# EAGLE design MicroMod-RP2040-ProcessorBoard (EAGLE 9.6.2)
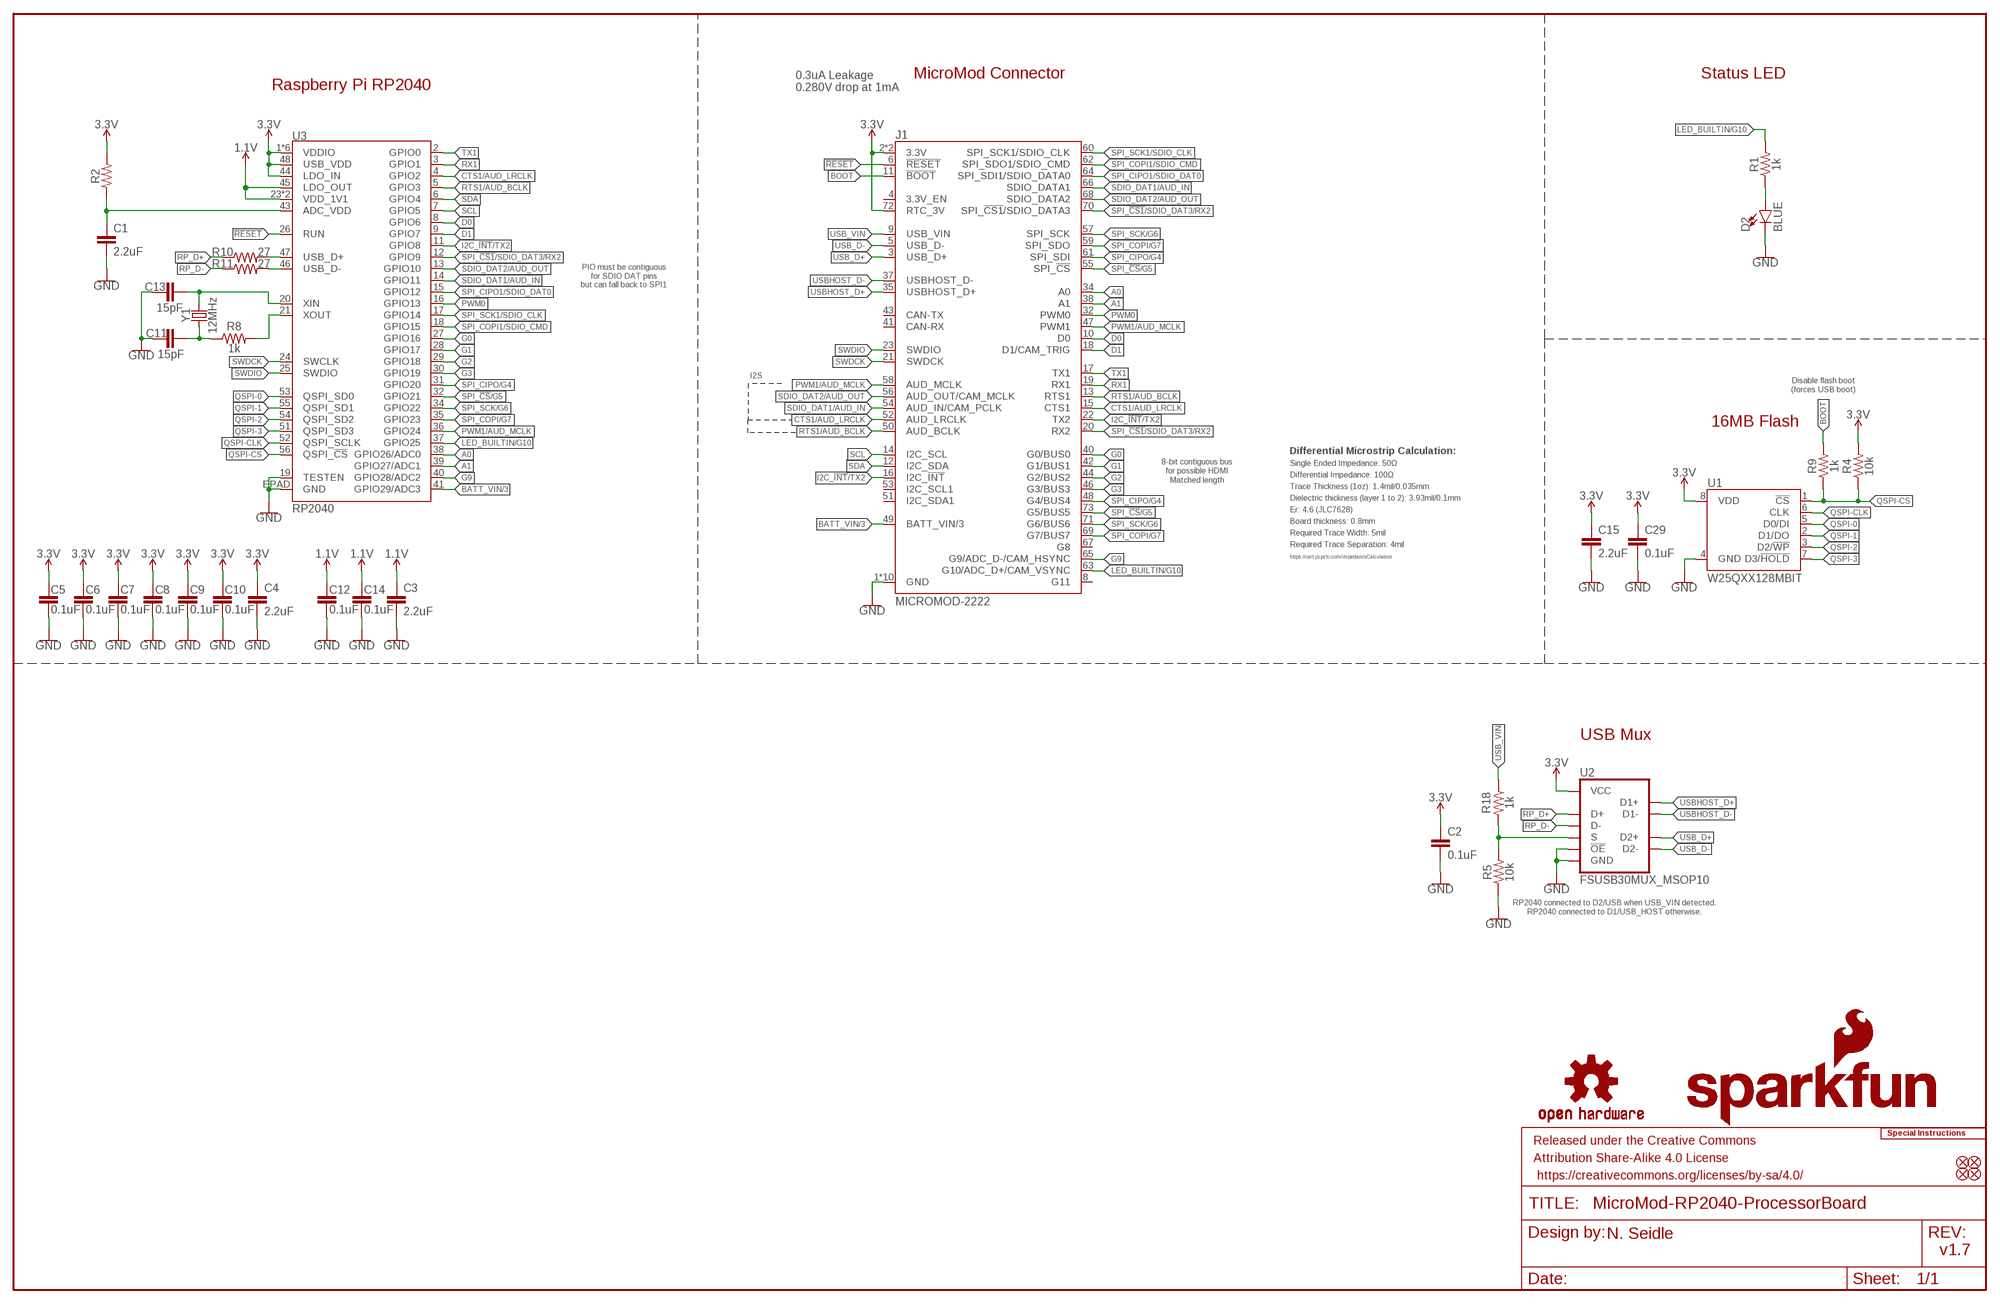
[diagram p0: schematic, sheet 1]

## Parts
C1  2.2uF  2.2UF-0402_TIGHT-10V-10%-X5R  [0402-TIGHT]
C2  0.1uF  0.1UF-0402T-6.3V-10%-X7R  [0402-TIGHT]
C3  2.2uF  2.2UF-0402_TIGHT-10V-10%-X5R  [0402-TIGHT]
C4  2.2uF  2.2UF-0402_TIGHT-10V-10%-X5R  [0402-TIGHT]
C5  0.1uF  0.1UF-0402T-6.3V-10%-X7R  [0402-TIGHT]
C6  0.1uF  0.1UF-0402T-6.3V-10%-X7R  [0402-TIGHT]
C7  0.1uF  0.1UF-0402T-6.3V-10%-X7R  [0402-TIGHT]
C8  0.1uF  0.1UF-0402T-6.3V-10%-X7R  [0402-TIGHT]
C9  0.1uF  0.1UF-0402T-6.3V-10%-X7R  [0402-TIGHT]
C10  0.1uF  0.1UF-0402T-6.3V-10%-X7R  [0402-TIGHT]
C11  15pF  15PF-0402T-50V-5%  [0402-TIGHT]
C12  0.1uF  0.1UF-0402T-6.3V-10%-X7R  [0402-TIGHT]
C13  15pF  15PF-0402T-50V-5%  [0402-TIGHT]
C14  0.1uF  0.1UF-0402T-6.3V-10%-X7R  [0402-TIGHT]
C15  2.2uF  2.2UF-0402_TIGHT-10V-10%-X5R  [0402-TIGHT]
C29  0.1uF  0.1UF-0402T-6.3V-10%-X7R  [0402-TIGHT]
D2  BLUE  LED-BLUE0603  [LED-0603]
FD1  FIDUCIALUFIDUCIAL  [FIDUCIAL-MICRO]
FD2  FIDUCIALUFIDUCIAL  [FIDUCIAL-MICRO]
FD3  FIDUCIALUFIDUCIAL  [FIDUCIAL-MICRO]
FD4  FIDUCIALUFIDUCIAL  [FIDUCIAL-MICRO]
FRAME1  FRAME-LEDGER  [CREATIVE_COMMONS]
J1  MICROMOD-2222  [M.2-CARD-E-22]
LOGO1  SFE_LOGO_NAME_FLAME.1_INCH  [SFE_LOGO_NAME_FLAME_.1]
LOGO2  SFE_LOGO_FLAME.1_INCH  [SFE_LOGO_FLAME_.1]
LOGO3  OSHW-LOGOMINI  [OSHW-LOGO-MINI]
LOGO4  SPECIAL_INSTRUCTIONS-ORDERING  [ORDERING_INSTRUCTIONS]
R1  1k  1KOHM-0402T-1/16W-1%  [0402-TIGHT]
R2  200OHM-0402T-1/16W-1%  [0402-TIGHT]
R4  10k  10KOHM-0402T-1/16W-1%  [0402-TIGHT]
R5  10k  10KOHM-0402T-1/16W-1%  [0402-TIGHT]
R8  1k  1KOHM-0402T-1/16W-1%  [0402-TIGHT]
R9  1k  1KOHM-0402T-1/16W-1%  [0402-TIGHT]
R10  27  27OHM  [0402-TIGHT]
R11  27  27OHM  [0402-TIGHT]
R18  1k  1KOHM-0402T-1/16W-1%  [0402-TIGHT]
U1  W25QXX128MBIT  W25QXX128MBIT-6X5-SKINNY_CENTER  [WSON-8-6X5-SKINNY_CENTERPAD]
U2  FSUSB30MUX_MSOP10  [MSOP10]
U3  RP2040  [QFN-56]
Y1  12MHz  CRYSTAL-12MHZ  [CRYSTAL-SMD-2X2.5MM]

## Nets
1.1V: C3.1 C12.1 C14.1 U3.23(VDD_1V1) U3.45(LDO_OUT) U3.50(VDD_1V1)
3.3V: C2.1 C4.1 C5.1 C6.1 C7.1 C8.1 C9.1 C10.1 C15.1 C29.1 J1.2(3.3V) J1.72(RTC_3V) J1.74(3.3V) R2.2 R4.2 U1.8(VDD) U2.10(VCC) U3.1(VDDIO) U3.10(VDDIO) U3.22(VDDIO) U3.33(VDDIO) U3.42(VDDIO) U3.44(LDO_IN) U3.48(USB_VDD) U3.49(VDDIO)
!RESET!: J1.6(!RESET!) U3.26(RUN)
A0: J1.34(A0) U3.38(GPIO26/ADC0)
A1: J1.38(A1) U3.39(GPIO27/ADC1)
ADC_VDD: C1.1 R2.1 U3.43(ADC_VDD)
BATT_VIN/3: J1.49(BATT_VIN/3) U3.41(GPIO29/ADC3)
BOOT: J1.11(!BOOT!) R9.2
CTS1/AUD_LRCLK: J1.15(CTS1) J1.52(AUD_LRCLK) U3.4(GPIO2)
D0: J1.10(D0) U3.8(GPIO6)
D1: J1.18(D1/CAM_TRIG) U3.9(GPIO7)
G0 [DiffPair]: J1.40(G0/BUS0) U3.27(GPIO16)
G1 [DiffPair]: J1.42(G1/BUS1) U3.28(GPIO17)
G2 [DiffPair]: J1.44(G2/BUS2) U3.29(GPIO18)
G3 [DiffPair]: J1.46(G3/BUS3) U3.30(GPIO19)
G9: J1.65(G9/ADC_D-/CAM_HSYNC) U3.40(GPIO28/ADC2)
GND: C1.2 C2.2 C3.2 C4.2 C5.2 C6.2 C7.2 C8.2 C9.2 C10.2 C11.1 C12.2 C13.1 C14.2 C15.2 C29.2 D2.C J1.1(GND) J1.7(GND) J1.33(GND) J1.36(GND) J1.39(GND) J1.45(GND) J1.75(GND) J1.GND1(GND) J1.GND2(GND) J1.GND3(GND) R5.1 U1.4(GND) U2.5(GND) U2.9(!OE!) U3.19(TESTEN) U3.EPAD(GND)
I2C_!INT!/TX2: J1.16(I2C_!INT!) J1.22(TX2) U3.11(GPIO8)
LED_BUILTIN/G10: J1.63(G10/ADC_D+/CAM_VSYNC) R1.2 U3.37(GPIO25)
N$2: D2.A R1.1
N$4: R8.2 U3.21(XOUT)
N$5: C13.2 U3.20(XIN) Y1.P3
N$6: C11.2 R8.1 Y1.P1
PWM0: J1.32(PWM0) U3.16(GPIO13)
PWM1/AUD_MCLK: J1.47(PWM1) J1.58(AUD_MCLK) U3.36(GPIO24)
QSPI-0: U1.5(D0/DI) U3.53(QSPI_SD0)
QSPI-1: U1.2(D1/DO) U3.55(QSPI_SD1)
QSPI-2: U1.3(D2/!WP!) U3.54(QSPI_SD2)
QSPI-3: U1.7(D3/!HOLD!) U3.51(QSPI_SD3)
QSPI-CLK [Clock]: U1.6(CLK) U3.52(QSPI_SCLK)
QSPI-CS: R4.1 R9.1 U1.1(!CS!) U3.56(QSPI_!CS!)
RP_D1+: R10.2 U3.47(USB_D+)
RP_D1-: R11.2 U3.46(USB_D-)
RP_D+: R10.1 U2.4(D+)
RP_D-: R11.1 U2.6(D-)
RTS1/AUD_BCLK: J1.13(RTS1) J1.50(AUD_BCLK) U3.5(GPIO3)
RX1: J1.19(RX1) U3.3(GPIO1)
SCL: J1.14(I2C_SCL) U3.7(GPIO5)
SDA: J1.12(I2C_SDA) U3.6(GPIO4)
SDIO_DAT1/AUD_IN: J1.54(AUD_IN/CAM_PCLK) J1.66(SDIO_DATA1) U3.14(GPIO11)
SDIO_DAT2/AUD_OUT: J1.56(AUD_OUT/CAM_MCLK) J1.68(SDIO_DATA2) U3.13(GPIO10)
SPI_!CS1!/SDIO_DAT3/RX2: J1.20(RX2) J1.70(SPI_!CS1!/SDIO_DATA3) U3.12(GPIO9)
SPI_!CS!/G5 [DiffPair]: J1.55(SPI_!CS!) J1.73(G5/BUS5) U3.32(GPIO21)
SPI_CIPO1/SDIO_DAT0: J1.64(SPI_SDI1/SDIO_DATA0) U3.15(GPIO12)
SPI_CIPO/G4 [DiffPair]: J1.48(G4/BUS4) J1.61(SPI_SDI) U3.31(GPIO20)
SPI_COPI1/SDIO_CMD: J1.62(SPI_SDO1/SDIO_CMD) U3.18(GPIO15)
SPI_COPI/G7 [DiffPair]: J1.59(SPI_SDO) J1.69(G7/BUS7) U3.35(GPIO23)
SPI_SCK1/SDIO_CLK: J1.60(SPI_SCK1/SDIO_CLK) U3.17(GPIO14)
SPI_SCK/G6 [DiffPair]: J1.57(SPI_SCK) J1.71(G6/BUS6) U3.34(GPIO22)
SWDCK: J1.21(SWDCK) U3.24(SWCLK)
SWDIO: J1.23(SWDIO) U3.25(SWDIO)
TX1: J1.17(TX1) U3.2(GPIO0)
USB_D+: J1.3(USB_D+) U2.3(D2+)
USB_D-: J1.5(USB_D-) U2.7(D2-)
USB_MUX_SIG: R5.2 R18.2 U2.1(S)
USB_VIN: J1.9(USB_VIN) R18.1
USBHOST_D+: J1.35(USBHOST_D+) U2.2(D1+)
USBHOST_D-: J1.37(USBHOST_D-) U2.8(D1-)
Unconnected: J1.4(3.3V_EN) J1.8(G11) J1.41(CAN-RX) J1.43(CAN-TX) J1.51(I2C_SDA1) J1.53(I2C_SCL1) J1.67(G8)

## Notes on the sheet
- MicroMod Connector | Status LED
- Raspberry Pi RP2040
- 0.3uA Leakage
  0.280V drop at 1mA
- PIO must be contiguous
  for SDIO DAT pins
  but can fall back to SPI1
- I2S
- Disable flash boot
  (forces USB boot)
- 16MB Flash
- Differential Microstrip Calculation:
- 8-bit contiguous bus
  for possible HDMI
- Single Ended Impedance: 50Ω
- Differential Impedance: 100Ω
- Matched length
- Trace Thickness (1oz): 1.4mil/0.035mm
- Dielectric thickness (layer 1 to 2): 3.93mil/0.1mm
- Er: 4.6 (JLC7628)
- Board thickness: 0.8mm
- Required Trace Width: 5mil
- Required Trace Separation: 4mil
- https://cart.jlcpcb.com/impedanceCalculation
- USB Mux
- RP2040 connected to D2/USB when USB_VIN detected.
  RP2040 connected to D1/USB_HOST otherwise.
- N. Seidle
- v1.7

## Library data of the parts
C1 C3 C4 C15 = SparkFun-Capacitors:2.2UF: 2.2µF ceramic capacitors A capacitor is a passive two-terminal electrical component used to store electrical energy temporarily in an electric field.; PROD_ID: CAP-14232
C2 C5-C10 C12 C14 C29 = SparkFun-Capacitors:0.1UF: 0.1µF ceramic capacitors A capacitor is a passive two-terminal electrical component used to store electrical energy temporarily in an electric field.; PROD_ID: CAP-14993
C11 C13 = SparkFun-Capacitors:15PF: 15pF ceramic capacitors A capacitor is a passive two-terminal electrical component used to store electrical energy temporarily in an electric field.; PROD_ID: CAP-13063
D2 = SparkFun-LED:LED-BLUE: Blue SMD LED Used in manufacturing of various products at SparkFun Packages: 0603 - SMD 0603 package [Product Link] <http://www.digikey.com/product-detail/en/SMLE12BC7TT86/511-1589-2-ND/1641808> 1206 - SMD1206 package [Product Link] <http://www.digikey.com/product-detail/en/lite-on-inc/LTST-C150TBKT/160-1643-1-ND/573584> SparkFun Products: ESP8266 Thing-Dev Board <https://www.sparkfun.com/products/13711> RedBoard <https://www.sparkfun.com/products/12757>; PROD_ID: DIO-08575
FD1-FD4 = SparkFun-Aesthetics:FIDUCIAL: Fiducial Alignment Points Point-of-reference for pick-and-place machines and other optical instruments.
FRAME1 = SparkFun-Aesthetics:FRAME-LEDGER: Schematic Frame - Ledger Standard 11x14 US Ledger frame
J1 = SparkFun-MicroMod:MICROMOD: MicroMod Connector Description: A card edge connector and mating PCB connector to allow various MicroMod Processor Boards to be coupled with various carrier boards of different capabilities. Based on the M.2 standard.
LOGO1 = SparkFun-Aesthetics:SFE_LOGO_NAME_FLAME: SparkFun Font Logo w/ Flame This is the SparkFun full logo. The logo on the schematic will always be the same size; the package variant is the height of the flame part of the logo. Default layer for the logo on the board is tSilk.
LOGO2 = SparkFun-Aesthetics:SFE_LOGO_FLAME: SparkFun Flame Logo This is the SparkFun flame logo. The logo on the schematic will always be the same size; the package variant is the height of the flame. Default layer for the logo on the board is tSilk.
LOGO3 = SparkFun-Aesthetics:OSHW-LOGO: Open-Source Hardware (OSHW) Logo This logo indicates the piece of hardware it is found on incorporates a OSHW license and/or adheres to the definition of open source hardware found here: http://freedomdefined.org/OSHW
LOGO4 = SparkFun-Aesthetics:SPECIAL_INSTRUCTIONS: Special Ordering/Production Instructions Alert Symbol for special PCB ordering instructions or unique production process warnings. Ordering Instructions Production Instructions Types of information that should be added to box: Copper weight Soldermask color Silk color PCB thickness Number of layers PCB Standard: 1.6mm FR4 1 oz copper immersion silver plating red soldermask white silkscreen Types of information that should be added to box: Special wash requirements Depaneling instructions Humidification Glue curing Default text settings: 0.07 inch 9% ratio 50% line distance
R1 R8 R9 R18 = SparkFun-Resistors:1KOHM: 1kΩ resistor A resistor is a passive two-terminal electrical component that implements electrical resistance as a circuit element. Resistors act to reduce current flow, and, at the same time, act to lower voltage levels within circuits. - Wikipedia; PROD_ID: RES-14342
R2 = SparkFun-Resistors:200OHM: 200Ω resistor A resistor is a passive two-terminal electrical component that implements electrical resistance as a circuit element. Resistors act to reduce current flow, and, at the same time, act to lower voltage levels within circuits. - Wikipedia; PROD_ID: RES-15550
R4 R5 = SparkFun-Resistors:10KOHM: 10kΩ resistor A resistor is a passive two-terminal electrical component that implements electrical resistance as a circuit element. Resistors act to reduce current flow, and, at the same time, act to lower voltage levels within circuits. - Wikipedia; PROD_ID: RES-14241
R10 R11 = SparkFun-Resistors:27OHM: 27Ω resistor A resistor is a passive two-terminal electrical component that implements electrical resistance as a circuit element. Resistors act to reduce current flow, and, at the same time, act to lower voltage levels within circuits. - Wikipedia; PROD_ID: RES-15238
U1 = SparkFun-IC-Memory:W25QXX; PROD_ID: IC-15107
U2 = SparkFun-IC-Special-Function:FSUSB30MUX; PROD_ID: IC-15569
U3 = RP2040:RP2040: Raspberry Pi RP2040 MCU 56-pin 32-bit Microcontroller with 264kB of SRAM and external flash support up to 16MB Getting Started with the RP2040 <https://pico.raspberrypi.org/getting-started/> Dual-core ARM Cortex M0+ processor, flexible clock running up to 133 MHz 264kB of SRAM, and QSPI control of common flash memory USB 1.1 Host and Device support Low-power sleep and dormant modes Drag & drop programming using mass storage over USB 26 multi-function GPIO pins 2×SPI, 2×I2C, 2×UART, 3×12-bit ADC, 16×controllable PWM channels Accurate clock and timer on-chip Temperature sensor Accelerated floating point libraries on-chip 8×Programmable IO (PIO) state machines for custom peripheral support; PROD_ID: IC-15502
Y1 = SparkFun-Clocks:CRYSTAL-12MHZ: 12.0MHz Crystal Frequency: 12.0MHz Frequency Tolerance: ±20ppm Load Capacitance: 18pF SparkFun Products: SparkFun Logomatic <https://www.sparkfun.com/products/12772> Pocket AVR Programmer <https://www.sparkfun.com/products/9825>; PROD_ID: XTAL-15540

## Net classes
1 DiffPair: width 0.127 mm, clearance 0.178 mm
2 Clock: width 0.089 mm, clearance 0.178 mm
4 InternalPower: width 0.152 mm

## Board
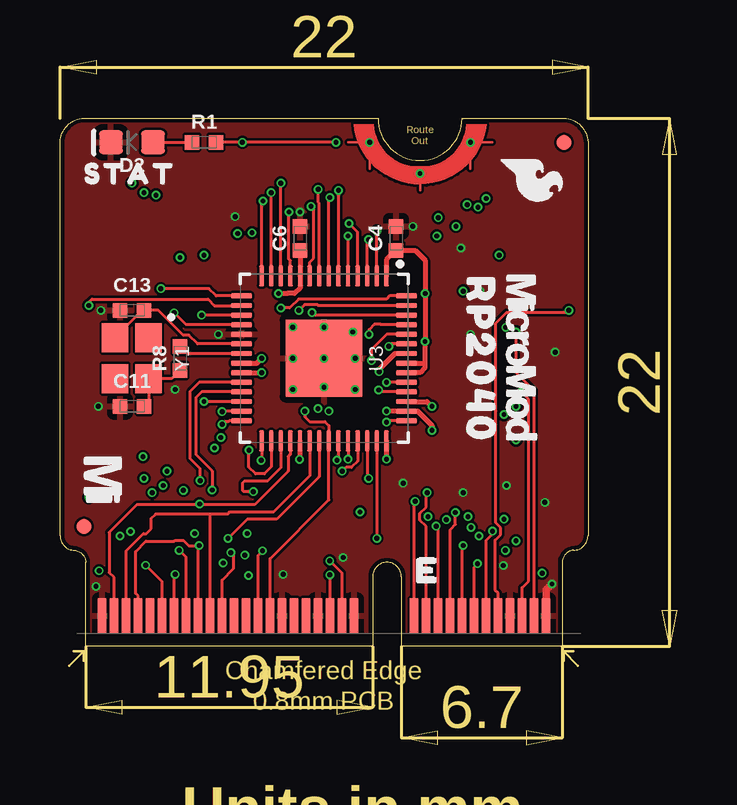
[diagram p1: board, top side]
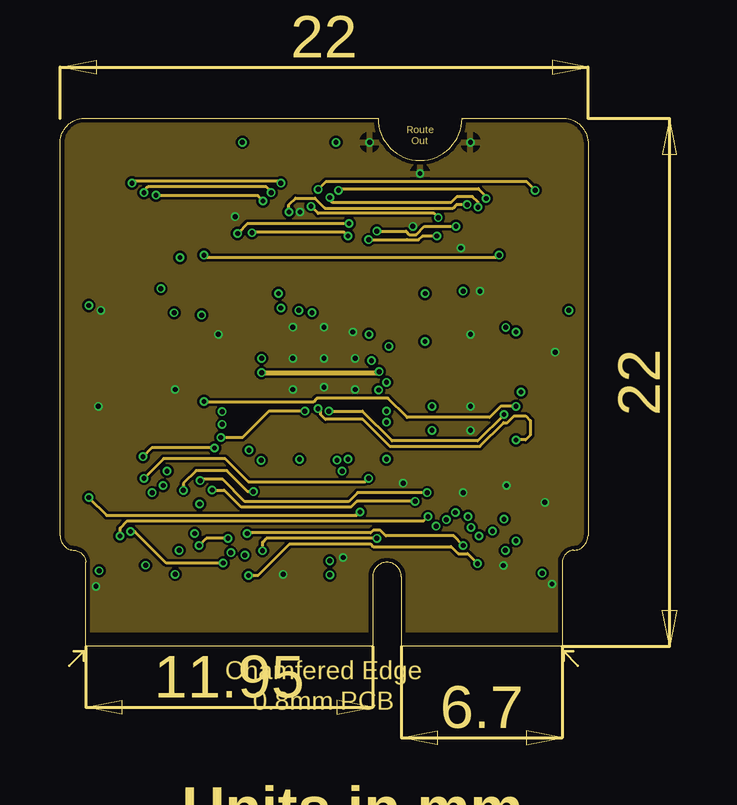
[diagram p2: board, inner layer Horz]
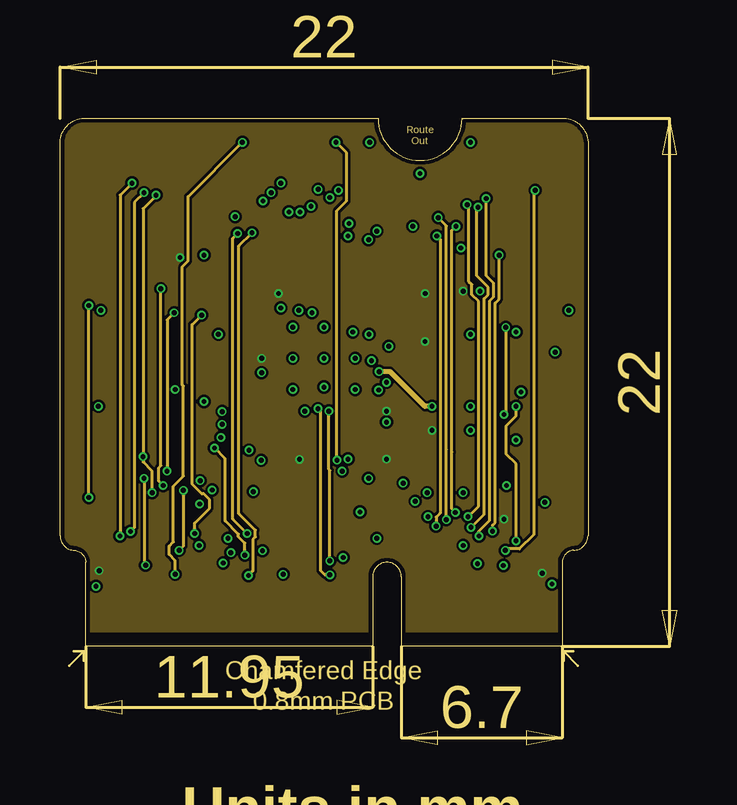
[diagram p3: board, inner layer Vert]
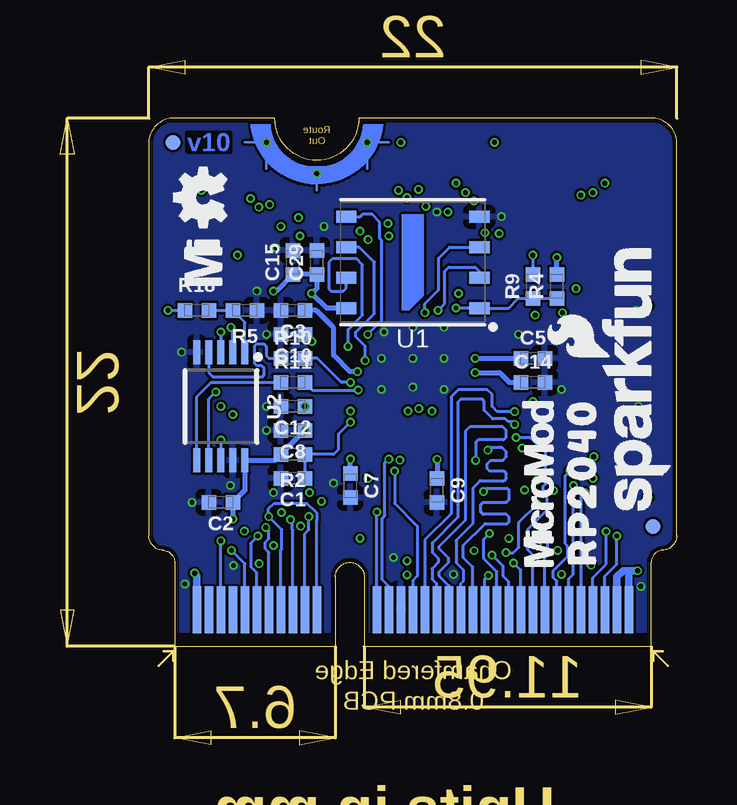
[diagram p4: board, bottom side, seen from below]

Size 22 x 22 mm. Coordinates in mm from the lower left corner, seen from the top.
Outline: 0,4.6 0,21 arc-87 1,22 13.25,22 arc180 16.75,22 21,22 arc-87 22,21 22,4.6
Outline: 0,4.6 arc87 0.6,4
Outline: 21.4,4 arc87 22,4.6
Outline: 21.4,4 arc85 20.93,3.5 20.93,0 14.22,0 14.22,2.9 arc180 13.03,2.9 13.03,0 1.07,0 1.07,3.5 arc84 0.6,4
Outline: 21.4,4 arc87 22,4.6
Outline: 0,4.6 arc87 0.6,4
Copper layers (1+2*15+16): Top 0.035mm / dielectric 1.5mm / Horz 0.035mm / dielectric 0.15mm / Vert 0.035mm / dielectric 0.2mm / Bottom 0.035mm
Design rules "SparkFun-4-layer-MicroMod": minimum track width 4mil, minimum drill 0.2mm, track to track 4mil, track to pad 4mil, pad to pad 4mil, via to via 4mil, smd to smd 4mil, copper to edge 6mil, drill to drill 6mil, minimum pad ring 3mil, minimum via ring 3mil, stop-mask expansion 4mil, vias tented up to drill 25mil, thermal gap 10mil

### Footprints (pad centres in the part's own frame; a part is rotated, then mirrored left to right if it is on the bottom)
0402-TIGHT = smd 0.6 x 0.6: 1 -0.5,0; 2 0.5,0
LED-0603 = smd 1 x 1: A -0.877,0; C 0.877,0
FIDUCIAL-MICRO = smd 0.635 x 0.635: 1 0,0
M.2-CARD-E-22 = smd 0.35 x 1.45: 1 9.25,1.275; 3 8.75,1.275; 5 8.25,1.275; 7 7.75,1.275; 9 7.25,1.275; 11 6.75,1.275; 13 6.25,1.275; 15 5.75,1.275; 17 5.25,1.275; 19 4.75,1.275; 21 4.25,1.275; 23 3.75,1.275; 33 1.25,1.275; 35 0.75,1.275; 37 0.25,1.275; 39 -0.25,1.275; 41 -0.75,1.275; 43 -1.25,1.275; 45 -1.75,1.275; 47 -2.25,1.275; 49 -2.75,1.275; 51 -3.25,1.275; 53 -3.75,1.275; 55 -4.25,1.275; 57 -4.75,1.275; 59 -5.25,1.275; 61 -5.75,1.275; 63 -6.25,1.275; 65 -6.75,1.275; 67 -7.25,1.275; 69 -7.75,1.275; 71 -8.25,1.275; 73 -8.75,1.275; 75 -9.25,1.275 | smd 0.35 x 1.95 bottom: 2 9,1.525; 4 8.5,1.525; 6 8,1.525; 8 7.5,1.525; 10 7,1.525; 12 6.5,1.525; 14 6,1.525; 16 5.5,1.525; 18 5,1.525; 20 4.5,1.525; 22 4,1.525; 32 1.5,1.525; 34 1,1.525; 36 0.5,1.525; 38 0,1.525; 40 -0.5,1.525; 42 -1,1.525; 44 -1.5,1.525; 46 -2,1.525; 48 -2.5,1.525; 50 -3,1.525; 52 -3.5,1.525; 54 -4,1.525; 56 -4.5,1.525; 58 -5,1.525; 60 -5.5,1.525; 62 -6,1.525; 64 -6.5,1.525; 66 -7,1.525; 68 -7.5,1.525; 70 -8,1.525; 72 -8.5,1.525; 74 -9,1.525 | drill 0.2: GND1 1.9,21; GND2 4,19.7; GND3 6.1,21
WSON-8-6X5-SKINNY_CENTERPAD = smd 0.85 x 0.5: 1 -2.775,1.905; 2 -2.775,0.635; 3 -2.775,-0.635; 4 -2.775,-1.905; 5 2.775,-1.905; 6 2.775,-0.635; 7 2.775,0.635; 8 2.775,1.905
MSOP10 = smd 1 x 0.3: 1 -2.25,1; 2 -2.25,0.5; 3 -2.25,0; 4 -2.25,-0.5; 5 -2.25,-1; 6 2.25,-1; 7 2.25,-0.5; 8 2.25,0; 9 2.25,0.5; 10 2.25,1
QFN-56 = smd 0.875 x 0.2: 1 -3.437,2.6; 2 -3.437,2.2; 3 -3.437,1.8; 4 -3.437,1.4; 5 -3.437,1; 6 -3.437,0.6; 7 -3.437,0.2; 8 -3.437,-0.2; 9 -3.437,-0.6; 10 -3.437,-1; 11 -3.437,-1.4; 12 -3.437,-1.8; 13 -3.437,-2.2; 14 -3.437,-2.6; 29 3.437,-2.6; 30 3.437,-2.2; 31 3.437,-1.8; 32 3.437,-1.4; 33 3.437,-1; 34 3.437,-0.6; 35 3.437,-0.2; 36 3.437,0.2; 37 3.437,0.6; 38 3.437,1; 39 3.437,1.4; 40 3.437,1.8; 41 3.437,2.2; 42 3.437,2.6 | smd 0.2 x 0.875: 15 -2.6,-3.437; 16 -2.2,-3.437; 17 -1.8,-3.437; 18 -1.4,-3.437; 19 -1,-3.437; 20 -0.6,-3.437; 21 -0.2,-3.437; 22 0.2,-3.437; 23 0.6,-3.437; 24 1,-3.437; 25 1.4,-3.437; 26 1.8,-3.437; 27 2.2,-3.437; 28 2.6,-3.437; 43 2.6,3.437; 44 2.2,3.437; 45 1.8,3.437; 46 1.4,3.437; 47 1,3.437; 48 0.6,3.437; 49 0.2,3.437; 50 -0.2,3.437; 51 -0.6,3.437; 52 -1,3.437; 53 -1.4,3.437; 54 -1.8,3.437; 55 -2.2,3.437; 56 -2.6,3.437 | smd 3.2 x 3.2: EPAD 0,0
CRYSTAL-SMD-2X2.5MM = smd 1.2 x 1.1: P1 0.846,0.69; P2 -0.854,0.69; P3 -0.854,-0.71; P4 0.846,-0.71

### Placement (x,y rotation side)
C1  16,7 180 bottom
C2  19,6 180 bottom
C3  16,14 180 bottom
C4  14,17 90 top
C5  6,12 0 bottom
C6  10,17 90 top
C7  13.6,6.7 270 bottom
C8  16,9 180 bottom
C9  10,6.5 270 bottom
C10  16,13 180 bottom
C11  3,10 0 top
C12  16,10 180 bottom
C13  3,14 0 top
C14  6,11 0 bottom
C15  16,16 90 bottom
C29  15,16 90 bottom
D2  3,21 180 top
FD1  1,5 0 top
FD2  21,21 0 top
FD3  21,21 0 bottom
FD4  1,5 0 bottom
FRAME1  -8.89,-15.24 0 top  (outside the outline)
J1  11,0 0 top
LOGO1  1.7,11.2 90 bottom
LOGO2  19.68,19.43 270 top
LOGO3  19.75,18.7 90 bottom
LOGO4  30.89,50.8 0 top  (outside the outline)
R1  6,21 0 top
R2  16,8 180 bottom
R4  5,15 90 bottom
R5  18,14 180 bottom
R8  5,12 90 top
R9  6,15 90 bottom
R10  16,12 0 bottom
R11  16,11 0 bottom
R18  20,14 0 bottom
U1  11,16 180 bottom
U2  19,10 270 bottom
U3  11,12 270 top
U$1  [MICROMOD_MI_LOGO_.35]  1.81,6.97 270 top
U$3  [MICROMOD_LOGO_.3]  5.71,6.73 90 bottom
U$4  [RP20400]  3.94,6.86 90 bottom
U$7  [MICROMOD_MI_LOGO_.35]  19.75,15.96 90 bottom
U$9  [RP20400]  17.53,11.94 270 top
U$11  [STAT0]  0.38,19.68 0 top
U$12  [MICROMOD_LOGO_.3]  19.18,12.06 270 top
Y1  3,12 270 top

### Tracks (layer width: path | path; a pad name or v marks a point on that pad's centre or on a via)
1.1V  (via drill 0.2)
  Top 0.203: U3.45 15.3,10.2 C12.1 | U3.50 13.95,12.2 13.3,11.55 v13.3,11.45 | U3.23 v8.4,11.4
  Horz 0.127: v13.3,11.45 13.3,11.4
  Horz 0.203: v8.4,11.4 13.3,11.4
  Vert 0.203: C12.1 15.2,10 13.75,11.45 v13.3,11.45
  Bottom 0.203: v8.4,11.4 7.38,11.4 6.98,11 C14.1 | v13.3,11.45 13.62,11.45 14.3,12.12 14.3,13.27 15.03,14 C3.1
  other vias: 15.5,10
3.3V  (via drill 0.2)
  Top 0.127: v15.21,12.7 v15.21,12.71
  Top 0.203: U3.42 v13.6,7.8 | v13.6,9.8 U3.44 14.9,9.8 15.5,9.2 C8.1 | U3.48 15,11.4 15.21,11.61 15.21,11.8 | v9.98,7.79 10,7.81 U3.33 | C6.1 U3.10 10,14.93 9.77,14.7 9.48,14.7 v9.1,14.7 | U3.1 13.6,16.1 C4.1 14.8,16.5 15.21,16.09 v15.21,14.7 v15.21,12.71 | v15.21,12.7 15.21,11.8 | U3.49 15.21,11.8 | U3.22 8.2,11.8 v8.4,12
  Bottom 0.127: v15.21,12.71 v15.21,12.7 | C9.1 9.98,7.02 | 15.18,14.7 v15.21,14.7
  Bottom 0.203: C10.1 v15.21,12.71 | v9.98,7.79 9.98,7.02 | R4.2 v5,16.2 | v18.5,5.3 C2.1 18,6.5 U2.10 16.75,7.75 R2.2 C8.1 | C7.1 v13.6,7.8 | v16.8,14.8 16.7,14.8 C15.1 C29.1 15,14.91 v15.21,14.7 | 15.18,14.7 14.57,14.1 U1.8 | v8.4,12 C5.1
  Bottom 0.305: J1.72 2.5,2.89 2.24,3.15 v1.63,3.15 1.93,3.15 2,3.08 J1.74 | J1.2 20,2.96 v20.09,3.05
  other vias: 15.5,9
  pour Vert (isolate 0.102): 0,22 22,22 22,0.64 0,0.64
!RESET!  (via drill 0.2)
  Top 0.127: U3.26 v6,10.2
  Horz 0.127: v6,10.2 10.56,10.2 10.71,10.34 13.66,10.34 14.46,9.54 17.9,9.54 18.36,10 v19,10
  Vert 0.127: v19,4.4 19,7.6 18.6,8 18.6,9.2 19,9.6 v19,10
  Bottom 0.127: J1.6 v19,4.4
A0  (via drill 0.2)
  Top 0.127: U3.38 v12,7.8
  Bottom 0.127: J1.34 12,2.5 12.27,2.77 12.27,5.35 12.16,5.46 12.16,7.64 v12,7.8
A1  (via drill 0.2)
  Top 0.127: v11.76,7.3 11.92,7.46 12.14,7.46 12.4,7.72 U3.39
  Bottom 0.127: v11.76,7.3 11.76,5.96 10.8,5 10.8,2.93 11,2.74 J1.38
ADC_VDD  (via drill 0.2)
  Top 0.127: U3.43 13.66,9.4 v13.6,9.34
  Bottom 0.127: v13.6,9.34 14.1,8.84 14.1,8.2 14.3,8 R2.1 C1.1
BATT_VIN/3  (via drill 0.2)
  Top 0.127: U3.41 v13.2,4.5 | v8.44,3.98 8.25,3.79 J1.49
  Horz 0.127: v13.2,4.5 8.6,4.5 8.44,4.34 v8.44,3.98
BOOT  (via drill 0.2)
  Top 0.127: J1.11 17.75,4.41 18.02,4.68 v18.02,4.8
  Horz 0.127: v18.3,16.3 18.2,16.2 6.1,16.2 v6,16.3
  Vert 0.127: v18.02,4.8 18.02,5.05 18.13,5.15 18.13,14.3 18.3,14.47 v18.3,16.3
  Bottom 0.127: v6,16.3 R9.2
CTS1/AUD_LRCLK  (via drill 0.2)
  Top 0.127: U3.4 12.4,17.26 v12.04,17.62 | J1.15 16.75,4.15 v16.8,4.2
  Horz 0.127: v12.04,17.62 7.82,17.62 v7.4,17.2 | v16.8,4.2 16.4,4.6 13.58,4.6 13.34,4.84 13.06,4.84 12.95,4.73 7.83,4.73 v7.8,4.7
  Vert 0.127: v7.4,17.2 7.2,17 7.2,5.3 v7.8,4.7
  Bottom 0.127: J1.52 7.5,3.12 8.04,3.66 8.04,4.46 v7.8,4.7
D0  (via drill 0.2)
  Top 0.127: U3.8 10.8,18.47 10.76,18.51 v10.76,19.04
  Horz 0.127: v10.76,19.04 11.08,19.36 19.44,19.36 v19.8,19
  Vert 0.127: v18.56,4 18.61,4.06 19.14,4.06 19.75,4.66 19.75,18.95 v19.8,19
  Bottom 0.127: J1.10 18,3.44 v18.56,4
D1  (via drill 0.2)
  Top 0.127: U3.9 10.4,16 10.57,16.17 10.57,18.22 v10.46,18.33
  Horz 0.127: v10.46,18.33 10.76,18.03 15.59,18.03 v15.76,17.86
  Vert 0.127: v16.09,5.28 16.09,8.2 16.1,8.2 16.1,17.52 v15.76,17.86
  Bottom 0.127: v16.09,5.28 16.01,5.2 16.01,4.86 16,4.85 J1.18
G0  (via drill 0.2)
  Top 0.127: U3.27 6.78,9.8 v6.76,9.78
  Bottom 0.127: J1.40 10.5,4.43 9.4,5.53 9.4,10.39 9.11,10.7 7.9,10.7 7.7,10.49 7.7,10 7.48,9.78 v6.76,9.78
G1  (via drill 0.2)
  Top 0.127: U3.28 7.07,9.4 7.03,9.36 6.87,9.36 v6.76,9.25
  Bottom 0.127: v6.76,9.25 6.87,9.36 7.03,9.36 7.14,9.47 7.67,9.47 8.03,9.83 8.03,10.23 8.1,10.3 9,10.3 9.1,10.2 9.1,5.4 10.2,4.3 10.2,3.93 9.93,3.67 9.93,3.5 10.2,3.24 10.2,2.79 10,2.6 J1.42
G2  (via drill 0.2)
  Top 0.127: v8.38,7.75 8.4,7.77 U3.29
  Bottom 0.127: J1.44 9.5,2.53 9.89,2.92 9.89,3.11 9.51,3.5 9.51,3.67 9.89,4.06 9.89,4.18 8.79,5.27 8.79,8.97 8.6,9.17 7.27,9.17 7.12,9.02 7.12,8.7 7.22,8.6 8.27,8.6 8.38,8.48 v8.38,7.75
G3  (via drill 0.2)
  Top 0.127: v7.87,8.17 7.87,7.47 8.15,7.19 8.51,7.19 8.8,7.48 U3.30
  Bottom 0.127: J1.46 9,2.61 8.88,2.73 8.88,3.17 9.2,3.49 9.2,4.42 8.48,5.13 8.48,6.61 8.19,6.9 7.2,6.9 7.1,7 7.1,7.2 7.2,7.3 7.8,7.3 7.9,7.4 7.9,7.6 7.75,7.75 7.25,7.75 7.1,7.9 7.1,8.1 7.29,8.29 7.75,8.29 v7.87,8.17
G9  (via drill 0.2)
  Top 0.127: U3.40 12.8,7.06 v12.86,7 | J1.65 4.25,2.7 v3.57,3.38
  Horz 0.127: v3.5,7 4.32,7.82 6.88,7.82 7.83,6.86 12.72,6.86 v12.86,7
  Vert 0.127: v3.5,7 3.5,3.45 v3.57,3.38
GND  (via drill 0.2)
  Top 0.305: J1.1 20.25,2.35 v20.5,2.6
  other vias: 18.47,3.37 16.8,6.4 17.1,9 18.6,6.7 17.1,10 20.63,12.26 16.7,16.6 14.7,17.5 7.3,17.9 6.6,13 14.3,6.8 9.7,13.3 12.2,13.1 12.3,10.7 9.7,10.7 11,12 1.6,10 1.7,14 4.8,10.7 17.5,14.8 17.1,13 11.8,3.7 9.3,3 1.5,2.5 10,18.1 9.7,12 12.3,12 11,10.8 11,13.3 20.2,6
  pour Top (isolate 0.102): 0,22 22,22 22,0.6 0,0.6
  pour Bottom (isolate 0.102): 0,22 22,22 22,0.6 0,0.6
  pour Horz (isolate 0.102): 0,0.64 0,22 22,22 22,0.64
I2C_!INT!/TX2  (via drill 0.2)
  Top 0.127: U3.11 9.6,16.07 9.54,16.13 v9.54,18.09 v9.54,18.1
  Horz 0.127: v9.54,18.1 9.54,18.4 9.82,18.68 10.62,18.68 11.04,18.26 16.38,18.26 16.52,18.4 v16.96,18.4
  Vert 0.127: v17,5.4 17.44,5.84 17.44,14.38 17.16,14.66 17.16,15.08 17.04,15.19 17.04,18.32 v16.96,18.4
  Bottom 0.127: J1.16 16.5,4.02 16.46,4.06 16.46,4.86 v17,5.4 17.04,5.44 17.04,5.7 16.79,5.95 15.4,5.95 14.99,5.54 14.99,5.26 15,5.25 J1.22
LED_BUILTIN/G10  (via drill 0.2)
  Top 0.127: U3.37 11.6,7.81 v11.54,7.75 | v11.5,21 v7.6,21 R1.2 | J1.63 4.75,2.95 v4.8,3
  Vert 0.127: v11.54,7.75 11.54,18.16 11.94,18.56 11.94,20.56 v11.5,21 | v4.8,3 4.8,3.58 4.55,3.83 4.55,4.17 4.72,4.35 4.72,6.67 5.14,7.09 5.14,10.84 5.1,10.88 5.1,15.82 5.34,16.06 5.34,18.74 v7.6,21
N$2
  Top 0.127: D2.A R1.1
N$4
  Top 0.127: U3.21 5.3,12.2 R8.2
N$5
  Top 0.127: Y1.P3 3.44,14 C13.2 4.1,14 5.13,12.96 5.37,12.96 5.73,12.6 U3.20
N$6
  Top 0.127: R8.1 4.65,11.15 Y1.P1 3.69,10.19 C11.2
PWM0  (via drill 0.2)
  Top 0.127: U3.16 6.43,14.2 6.17,14.46 1.33,14.46 1.2,14.33 v1.2,14.2
  Horz 0.127: v1.2,6.2 1.95,5.45 12.35,5.45 v12.5,5.6
  Vert 0.127: v1.2,6.2 v1.2,14.2
  Bottom 0.127: J1.32 v12.5,5.6
PWM1/AUD_MCLK  (via drill 0.2)
  Top 0.127: J1.47 8.75,3.66 11.2,6.11 U3.36 11.2,9.2 11.04,9.36 10.4,9.36 10.2,9.56 v10.2,9.8
  Horz 0.127: v10.2,9.8 8.7,9.8 7.6,8.7 v6.7,8.7
  Bottom 0.127: v6.7,8.7 6.1,8.7 5.46,8.06 5.46,6.77 5.56,6.67 5.56,6.33 5.4,6.17 5.4,5.69 6.22,4.87 6.22,4.03 6,3.81 J1.58
QSPI-0  (via drill 0.2)
  Top 0.127: U3.53 13.37,13.4 13.36,13.42 13.1,13.42 12.88,13.2 v12.88,13
  Bottom 0.127: U1.5 13.2,17.91 13.1,18 12.7,18 12.38,17.68 12.38,17 12.3,16.92 12.3,13.58 v12.88,13
QSPI-1  (via drill 0.2)
  Top 0.127: U3.55 10.76,14.2 10.72,14.24 10.2,14.24 v9.95,14
  Bottom 0.127: U1.2 8.22,15.62 8.4,15.8 9.5,15.8 9.7,15.6 9.7,14.25 v9.95,14
QSPI-2  (via drill 0.2)
  Top 0.127: U3.54 10.6,13.8 v10.5,13.9
  Bottom 0.127: v10.5,13.9 10.5,14.28 9.93,14.85 9.93,16.17 9.46,16.64 U1.3
QSPI-3  (via drill 0.2)
  Top 0.127: U3.51 13.8,12.6 v13.7,12.5
  Bottom 0.127: v13.7,12.5 13.7,13.2 13.1,13.8 13.1,15.9 13.34,16.14 14.36,16.14 14.5,16 14.5,14.9 14.4,14.8 13.9,14.8 13.78,14.93 U1.7
QSPI-CLK  (via drill 0.2)
  Top 0.127: U3.52 13.61,13 12.98,12.37 v12.98,11.9
  Bottom 0.127: v12.98,11.9 12.98,12.5 13.38,12.9 13.38,13.09 12.61,13.86 12.61,16 13.23,16.64 U1.6
QSPI-CS  (via drill 0.2)
  Top 0.127: v9.2,14.1 9.57,14.1 9.94,14.47 13.61,14.47 13.74,14.6 U3.56
  Bottom 0.127: R4.1 R9.1 6.6,14.5 7,14.1 U1.1 v9.2,14.1
RP_D1+  (via drill 0.2)
  Top 0.127: U3.47 v13.6,11
  Bottom 0.127: v13.6,11 13.98,11 14.98,12 R10.2
RP_D1-  (via drill 0.2)
  Top 0.127: U3.46 13.36,10.6 v13.28,10.68
  Bottom 0.127: v13.28,10.68 13.44,10.68 13.46,10.66 15.16,10.66 R11.2
RP_D+
  Bottom 0.127: U2.4 19.5,11.4 19.33,11.23 17.27,11.23 17.2,11.3 17.2,11.6 17.3,11.7 17.5,11.7 17.6,11.8 17.6,12.5 17.5,12.6 17.2,12.6 17.1,12.5 17.1,12.1 17,12 R10.1
RP_D-
  Bottom 0.127: U2.6 20,10.4 19.4,11 R11.1
RTS1/AUD_BCLK  (via drill 0.2)
  Top 0.127: U3.5 v12,17.1 | J1.13 17.25,3.29 v17.4,3.44
  Horz 0.127: v12,17.1 11.84,17.26 8.03,17.26 v8,17.23 | v17.4,3.44 16.98,3.86 16.6,3.86 16.3,4.16 13.06,4.16 12.95,4.27 9.57,4.27 8.26,2.96 v7.86,2.96
  Vert 0.127: v7.86,2.96 8.04,3.14 8.04,4.46 8.14,4.56 8.14,4.84 7.45,5.53 7.45,16.69 v8,17.23
  Bottom 0.127: J1.50 8,2.81 v7.86,2.96
RX1  (via drill 0.2)
  Top 0.127: U3.3 12.8,16.88 v12.86,16.94 | J1.19 15.75,4.93 v15.67,5
  Horz 0.127: v15.7,17.1 15.11,17.1 14.94,16.93 14.46,16.93 14.45,16.94 v12.86,16.94
  Vert 0.127: v15.7,17.1 15.84,16.96 15.84,5.55 15.67,5.39 v15.67,5
SCL  (via drill 0.2)
  Top 0.127: v11.24,18.7 11.2,18.66 U3.7
  Horz 0.127: v17.42,18.3 17.42,18.51 17.18,18.74 16.54,18.74 16.29,18.49 11.35,18.49 11.24,18.6 v11.24,18.7
  Vert 0.127: v17.13,4.96 17.67,5.5 17.67,14.49 17.84,14.66 17.84,14.96 17.37,15.43 17.37,18.25 v17.42,18.3
  Bottom 0.127: v17.13,4.96 17,4.83 17,4.48 17.14,4.34 17.14,4.06 17,3.92 J1.14
SDA  (via drill 0.2)
  Top 0.127: v11.6,19 U3.6
  Horz 0.127: v17.76,18.66 17.76,18.74 17.43,19.07 11.67,19.07 v11.6,19
  Vert 0.127: v17.45,4.6 17.45,4.8 17.9,5.25 17.9,14.39 18.07,14.56 18.07,15.13 17.76,15.44 v17.76,18.66
  Bottom 0.127: J1.12 17.5,3.06 17.74,3.3 17.74,4.31 v17.45,4.6
SDIO_DAT1/AUD_IN  (via drill 0.2)
  Top 0.127: U3.14 8.4,18.5 v8.46,18.56
  Horz 0.127: v8.46,18.56 8.24,18.77 4.03,18.77 v4,18.8 | v6.44,8.26 3.82,8.26 v3.46,7.9
  Vert 0.127: v4,18.8 4,18.78 3.46,18.24 v3.46,7.9 3.46,7.68 3.84,7.3 v3.84,6.4 | v7.7,3.8 7.7,4.3 7.43,4.57 7.43,4.68 6.88,5.23 6.88,7.82 v6.44,8.26
  Bottom 0.127: J1.54 7,2.69 7.24,2.93 7.24,3.34 v7.7,3.8 | v3.84,6.4 4,6.24 J1.66
SDIO_DAT2/AUD_OUT  (via drill 0.2)
  Top 0.127: U3.13 v8.8,18.9
  Horz 0.127: v3.5,18.9 3.5,18.98 3.66,19.14 8.6,19.14 8.8,18.94 v8.8,18.9 | v2.94,4.78 3.12,4.78 4.43,3.47 v6.8,3.47
  Vert 0.127: v3.5,18.9 3.1,18.5 3.1,4.94 v2.94,4.78
  Bottom 0.127: J1.68 3.5,2.86 2.94,3.42 v2.94,4.78 | J1.56 6.5,3.17 v6.8,3.47
SPI_!CS1!/SDIO_DAT3/RX2  (via drill 0.2)
  Top 0.127: U3.12 v9.2,19.3
  Horz 0.127: v9.2,19.3 9.16,19.3 9.09,19.37 3.06,19.37 v3,19.31 v3,19.3 | v15.33,5.4 15.15,5.22 2.8,5.22 2.5,4.92 v2.5,4.6
  Vert 0.127: v3,19.3 2.5,18.8 v2.5,4.6
  Bottom 0.127: J1.70 3,2.92 2.5,3.42 v2.5,4.6 | J1.20 15.5,4.7 15.33,4.86 v15.33,5.4
SPI_!CS!/G5  (via drill 0.2)
  Top 0.127: J1.73 2.25,2.88 2.05,3.08 2.05,4.75 3.2,5.9 5.82,5.9 v5.82,5.93 5.84,5.91 8.11,5.91 9.51,7.3 9.51,7.91 9.6,8 U3.32 | J1.55 6.75,2.76 7.22,3.23 7.22,3.8 v7.12,3.9
  Bottom 0.127: v5.82,5.93 6.58,5.16 6.58,4.13 6.8,3.9 v7.12,3.9
SPI_CIPO1/SDIO_DAT0  (via drill 0.2)
  Top 0.127: U3.15 6.5,14.6 6.2,14.9 v4.2,14.9
  Vert 0.127: v4.2,14.9 4.2,7.52 4.12,7.44 4.12,6.88 v4.3,6.7
  Bottom 0.127: J1.64 4.5,2.82 4.32,3 4.32,6.68 v4.3,6.7
SPI_CIPO/G4  (via drill 0.2)
  Top 0.127: J1.61 5.25,3.71 v4.96,4 | U3.31 9.2,7.45 8.64,6.88 7.68,6.88 7.6,6.8 7.6,6.5 7.66,6.45 v8.05,6.45
  Horz 0.127: v8.05,6.45 7.82,6.45 6.95,7.32 5.67,7.32 5.14,6.79 v5.14,6.5
  Vert 0.127: v5.14,6.5 5.14,4.18 v4.96,4
  Bottom 0.127: J1.48 8.5,3.3 8.89,3.69 8.89,4.21 7.98,5.12 7.07,5.12 6.99,5.2 6.99,5.39 7.1,5.5 8.08,5.5 8.18,5.6 8.18,5.9 8.08,6 7.1,6 6.99,6.11 6.99,6.5 7.08,6.59 7.91,6.59 v8.05,6.45
SPI_COPI1/SDIO_CMD  (via drill 0.2)
  Top 0.127: U3.18 5.26,13.4 v4.76,13.9
  Vert 0.127: v4.76,13.9 4.46,13.6 v4.46,7.3
  Bottom 0.127: v4.46,7.3 4.64,7.12 4.64,4.27 4.55,4.17 4.55,3.75 5.14,3.16 5.14,2.86 5,2.72 J1.62
SPI_COPI/G7  (via drill 0.2)
  Top 0.127: U3.35 10.8,7.07 9.03,5.29 7.8,5.29 v7.01,4.5 v7,4.5 | J1.69 3.25,2.11 3.15,2.21 3.15,3.95 3.58,4.38 4.76,4.38 4.79,4.42 5.14,4.42 5.36,4.2 v5.8,4.2 5.75,4.15 J1.59
  Horz 0.127: v5.8,4.2 6.1,4.5 v7,4.5
SPI_SCK1/SDIO_CLK  (via drill 0.2)
  Top 0.127: U3.17 v5.9,13.8
  Vert 0.127: v5.9,13.8 5.5,13.4 5.5,6.76 5.91,6.35 5.99,6.35 6.24,6.1 6.24,5.76 5.61,5.13 v5.61,4.7
  Bottom 0.127: J1.60 5.5,3.91 5.38,4.03 5.38,4.37 5.61,4.6 v5.61,4.7
SPI_SCK/G6
  Top 0.127: U3.34 10.4,7.1 8.9,5.6 7.08,5.6 6.99,5.51 6.3,5.51 | 6.3,5.51 3.98,5.51 3.8,5.33 3.8,4.9 3.6,4.7 3.47,4.7 2.75,3.98 J1.71 | J1.57 6.25,5.46 6.3,5.51
SWDCK  (via drill 0.2)
  Top 0.127: v15.3,6.4 15.25,6.35 15.25,5.8 14.99,5.54 14.99,5.26 15.25,5 J1.21 | v5.84,6.9 5.84,7.4 5.43,7.81 5.43,10.63 5.8,11 U3.24
  Horz 0.127: v15.3,6.4 12.4,6.4 12.03,6.03 7.71,6.03 6.78,6.95 5.89,6.95 v5.84,6.9
SWDIO  (via drill 0.2)
  Top 0.127: J1.23 14.75,5.99 v14.8,6.04 | U3.25 5.9,10.6 5.66,10.36 5.66,7.99 6.34,7.31 v6.34,6.51
  Horz 0.127: v14.8,6.04 12.37,6.04 12.12,5.8 7.55,5.8 6.84,6.51 v6.34,6.51
TX1  (via drill 0.2)
  Top 0.127: U3.2 v13.2,17.3 | J1.17 16.25,4.86 16.47,5.08 v16.47,5.58
  Horz 0.127: v16.5,17.5 15.18,17.5 14.84,17.16 14.56,17.16 14.42,17.3 v13.2,17.3
  Vert 0.127: v16.47,5.58 16.32,5.73 16.32,8.1 16.33,8.11 16.33,17.33 v16.5,17.5
USB_D+  (via drill 0.2)
  Top 0.127: J1.3 19.75,10.65 19,11.4 v19,13.1
  Bottom 0.127: v19,13.1 U2.3
USB_D-  (via drill 0.2)
  Top 0.127: J1.5 19.25,2.45 19.52,2.72 19.52,10.29 v19.21,10.6
  Bottom 0.127: U2.7 19.5,10.31 v19.21,10.6
USB_MUX_SIG
  Bottom 0.127: U2.1 18,13.5 R5.2 R18.2
USB_VIN  (via drill 0.2)
  Top 0.127: v21.2,14 21.1,13.9 18.6,13.9 18.16,13.46 18.16,9.8 18.16,5.14 18.36,4.94 18.36,4.66 18.13,4.42 18.13,2.34 18.25,2.23 J1.9
  Bottom 0.127: v21.2,14 R18.1
USBHOST_D+  (via drill 0.2)
  Top 0.127: J1.35 11.75,3.05 v11.24,3.56
  Horz 0.127: v18.5,9.66 17.4,8.56 13.84,8.56 12.6,9.8 v11.2,9.8
  Vert 0.127: v11.24,3.56 11.24,7.34 11.2,7.38 v11.2,9.8 | v18.57,13.29 18.57,9.73 v18.5,9.66
  Bottom 0.127: U2.2 18.5,13.22 v18.57,13.29
USBHOST_D-  (via drill 0.2)
  Top 0.127: J1.37 11.25,2.97 v11.24,2.98
  Horz 0.127: v10.75,9.9 10.86,9.79 10.86,9.66 11.06,9.46 12.62,9.46 13.75,8.33 17.5,8.33 18.48,9.32 18.64,9.32 18.92,9.6 19.4,9.6 19.6,9.4 19.6,8.8 19.4,8.6 v19,8.6
  Vert 0.127: v10.75,9.9 10.86,9.79 10.86,3.16 11.04,2.98 v11.24,2.98
  Bottom 0.127: v19,8.6 U2.8

### Text on the board
Bottom: v10
Dimension: Units in mm
tDocu: 0.8mm PCB / 45 degree chamfered edge / Four layer design | N. Seidle